# Altium schematic sheet RotaryEncoder.SchDoc
size A4; DrawnBy: Emile Renaud; Revision: V1.0; SheetNumber: 2; SheetTotal: 2
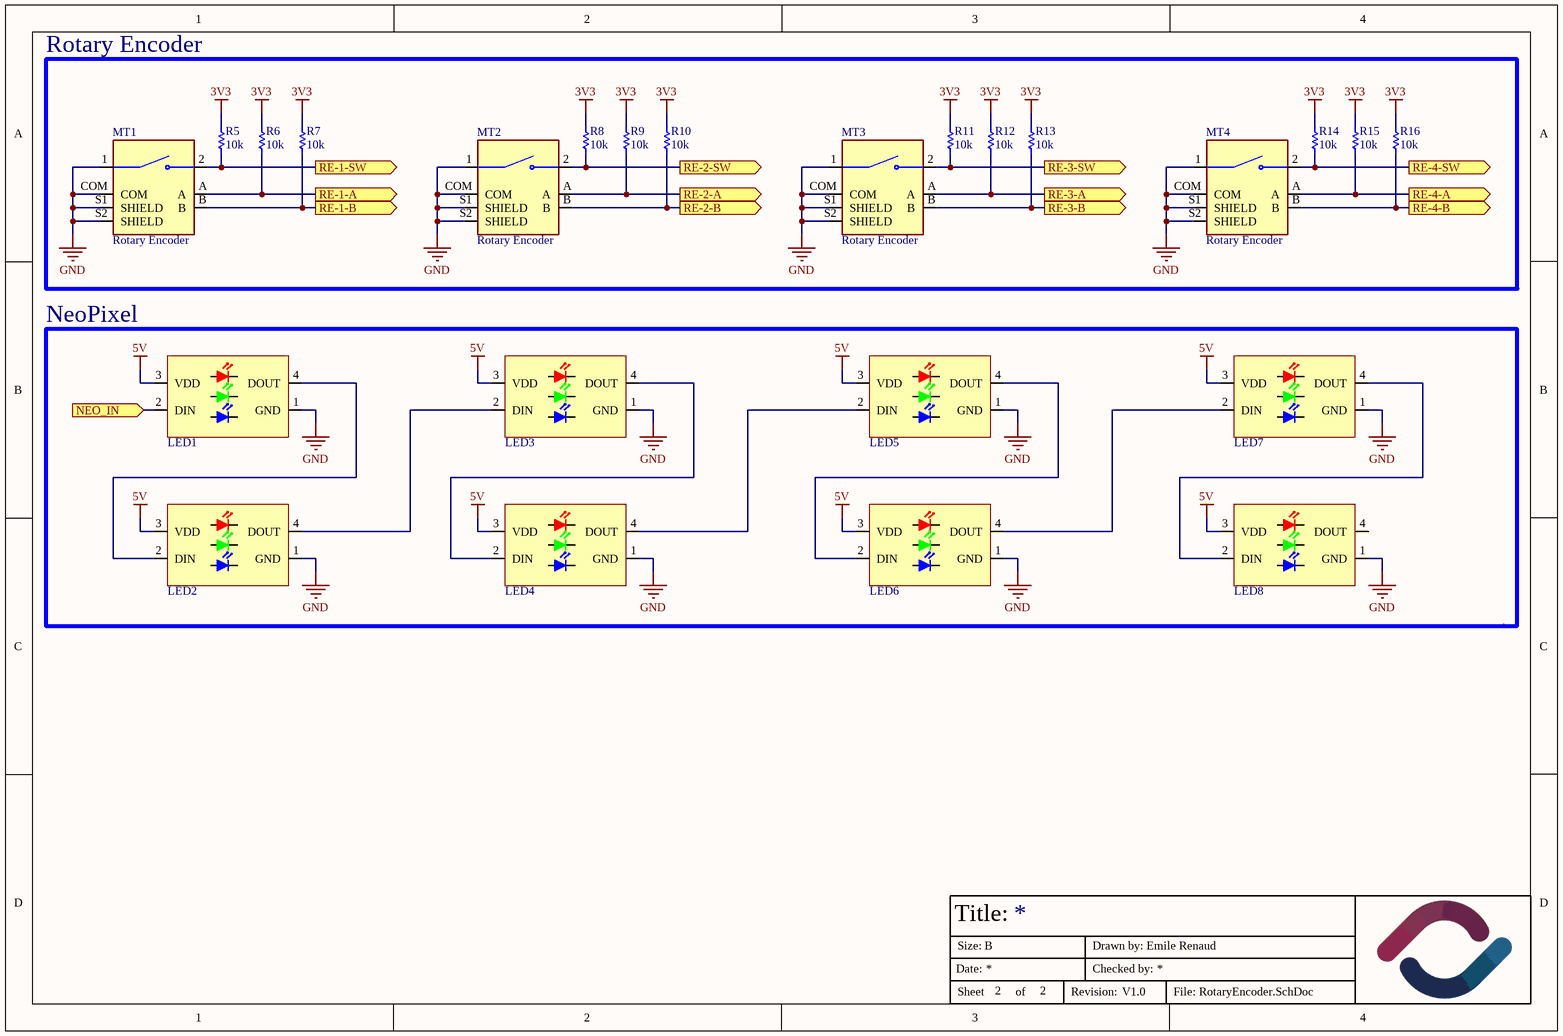
[diagram p0: RotaryEncoder.SchDoc]

## Parts
LED1  1528-1104-ND  [LED_NEO]  (value not drawn)
LED2  1528-1104-ND  [LED_NEO]  (value not drawn)
LED3  1528-1104-ND  [LED_NEO]  (value not drawn)
LED4  1528-1104-ND  [LED_NEO]  (value not drawn)
LED5  1528-1104-ND  [LED_NEO]  (value not drawn)
LED6  1528-1104-ND  [LED_NEO]  (value not drawn)
LED7  1528-1104-ND  [LED_NEO]  (value not drawn)
LED8  1528-1104-ND  [LED_NEO]  (value not drawn)
MT1  Rotary Encoder  [XDCR_PEC11R-4215F-S0024]
MT2  Rotary Encoder  [XDCR_PEC11R-4215F-S0024]
MT3  Rotary Encoder  [XDCR_PEC11R-4215F-S0024]
MT4  Rotary Encoder  [XDCR_PEC11R-4215F-S0024]
R5  value 10k  [Resistor-0603]  (hidden comment: SMT resistor)
R6  value 10k  [Resistor-0603]  (hidden comment: SMT resistor)
R7  value 10k  [Resistor-0603]  (hidden comment: SMT resistor)
R8  value 10k  [Resistor-0603]  (hidden comment: SMT resistor)
R9  value 10k  [Resistor-0603]  (hidden comment: SMT resistor)
R10  value 10k  [Resistor-0603]  (hidden comment: SMT resistor)
R11  value 10k  [Resistor-0603]  (hidden comment: SMT resistor)
R12  value 10k  [Resistor-0603]  (hidden comment: SMT resistor)
R13  value 10k  [Resistor-0603]  (hidden comment: SMT resistor)
R14  value 10k  [Resistor-0603]  (hidden comment: SMT resistor)
R15  value 10k  [Resistor-0603]  (hidden comment: SMT resistor)
R16  value 10k  [Resistor-0603]  (hidden comment: SMT resistor)

## Blocks framed on the sheet
Rotary Encoder: MT1-MT4 R5-R16
NeoPixel: LED1-LED8

## Ports
NEO_IN (in), RE-1-A (out), RE-1-B (out), RE-1-SW (out), RE-2-A (out), RE-2-B (out), RE-2-SW (out), RE-3-A (out), RE-3-B (out), RE-3-SW (out), RE-4-A (out), RE-4-B (out), RE-4-SW (out)

## Nets
3V3: R5.2 R6.2 R7.2 R8.2 R9.2 R10.2 R11.2 R12.2 R13.2 R14.2 R15.2 R16.2
5V: LED1.3(VDD) LED2.3(VDD) LED3.3(VDD) LED4.3(VDD) LED5.3(VDD) LED6.3(VDD) LED7.3(VDD) LED8.3(VDD)
GND: LED1.1(GND) LED2.1(GND) LED3.1(GND) LED4.1(GND) LED5.1(GND) LED6.1(GND) LED7.1(GND) LED8.1(GND) MT1.1 MT1.COM MT1.S1(SHIELD) MT1.S2(SHIELD) MT2.1 MT2.COM MT2.S1(SHIELD) MT2.S2(SHIELD) MT3.1 MT3.COM MT3.S1(SHIELD) MT3.S2(SHIELD) MT4.1 MT4.COM MT4.S1(SHIELD) MT4.S2(SHIELD)
NEO_IN: LED1.2(DIN) ; port NEO_IN
RE-1-A: MT1.A R6.1 ; port RE-1-A
RE-1-B: MT1.B R7.1 ; port RE-1-B
RE-1-SW: MT1.2 R5.1 ; port RE-1-SW
RE-2-A: MT2.A R9.1 ; port RE-2-A
RE-2-B: MT2.B R10.1 ; port RE-2-B
RE-2-SW: MT2.2 R8.1 ; port RE-2-SW
RE-3-A: MT3.A R12.1 ; port RE-3-A
RE-3-B: MT3.B R13.1 ; port RE-3-B
RE-3-SW: MT3.2 R11.1 ; port RE-3-SW
RE-4-A: MT4.A R15.1 ; port RE-4-A
RE-4-B: MT4.B R16.1 ; port RE-4-B
RE-4-SW: MT4.2 R14.1 ; port RE-4-SW
NetLED1_4: LED1.4(DOUT) LED2.2(DIN)
NetLED2_4: LED2.4(DOUT) LED3.2(DIN)
NetLED3_4: LED3.4(DOUT) LED4.2(DIN)
NetLED4_4: LED4.4(DOUT) LED5.2(DIN)
NetLED5_4: LED5.4(DOUT) LED6.2(DIN)
NetLED6_4: LED6.4(DOUT) LED7.2(DIN)
NetLED7_4: LED7.4(DOUT) LED8.2(DIN)

Not connected (* = marked no-connect by the designer): LED8 4(DOUT)

## Notes on the sheet
- Title:
- Date:
- Size:
- B
- Drawn by:
- Checked by:
- Sheet
- of
- Revision:
- File:

## Library data of the parts
LED1-LED8 = Led-NeoPixel: LED RGB COMMON CATHODE (0.95(L)X; Package / Case: 4-SMD; Mounted: Yes; Supplier 1: Digi-Key; Supplier Part Number 1: 1528-1104-ND
MT1-MT4 = PEC11R-4215F-S0024: Incremental Encoder, 12 Mm, Contact Rating 10 Ma - 5 Vdc; Price: None; Availability: Unavailable; MP: PEC11R-4215F-S0024; Value: *; Package: None
R5-R16 = Resistor0603-10k: Precision: 1%; Watt: 0.1W; Mounted: Yes; Package / Case: Metric 1608, EIA 0603; Supplier 2: Digi-Key; Supplier 4: Digi-Key; Supplier Part Number 2: RMCF0603FT10K0TR-ND; Supplier 1: Digi-Key; Supplier 3: Digi-Key; Supplier Part Number 1: 311-10.0KHRTR-ND